# Altium schematic sheet Sheet1.SchDoc
size A4; SheetNumber: 1; SheetTotal: 1
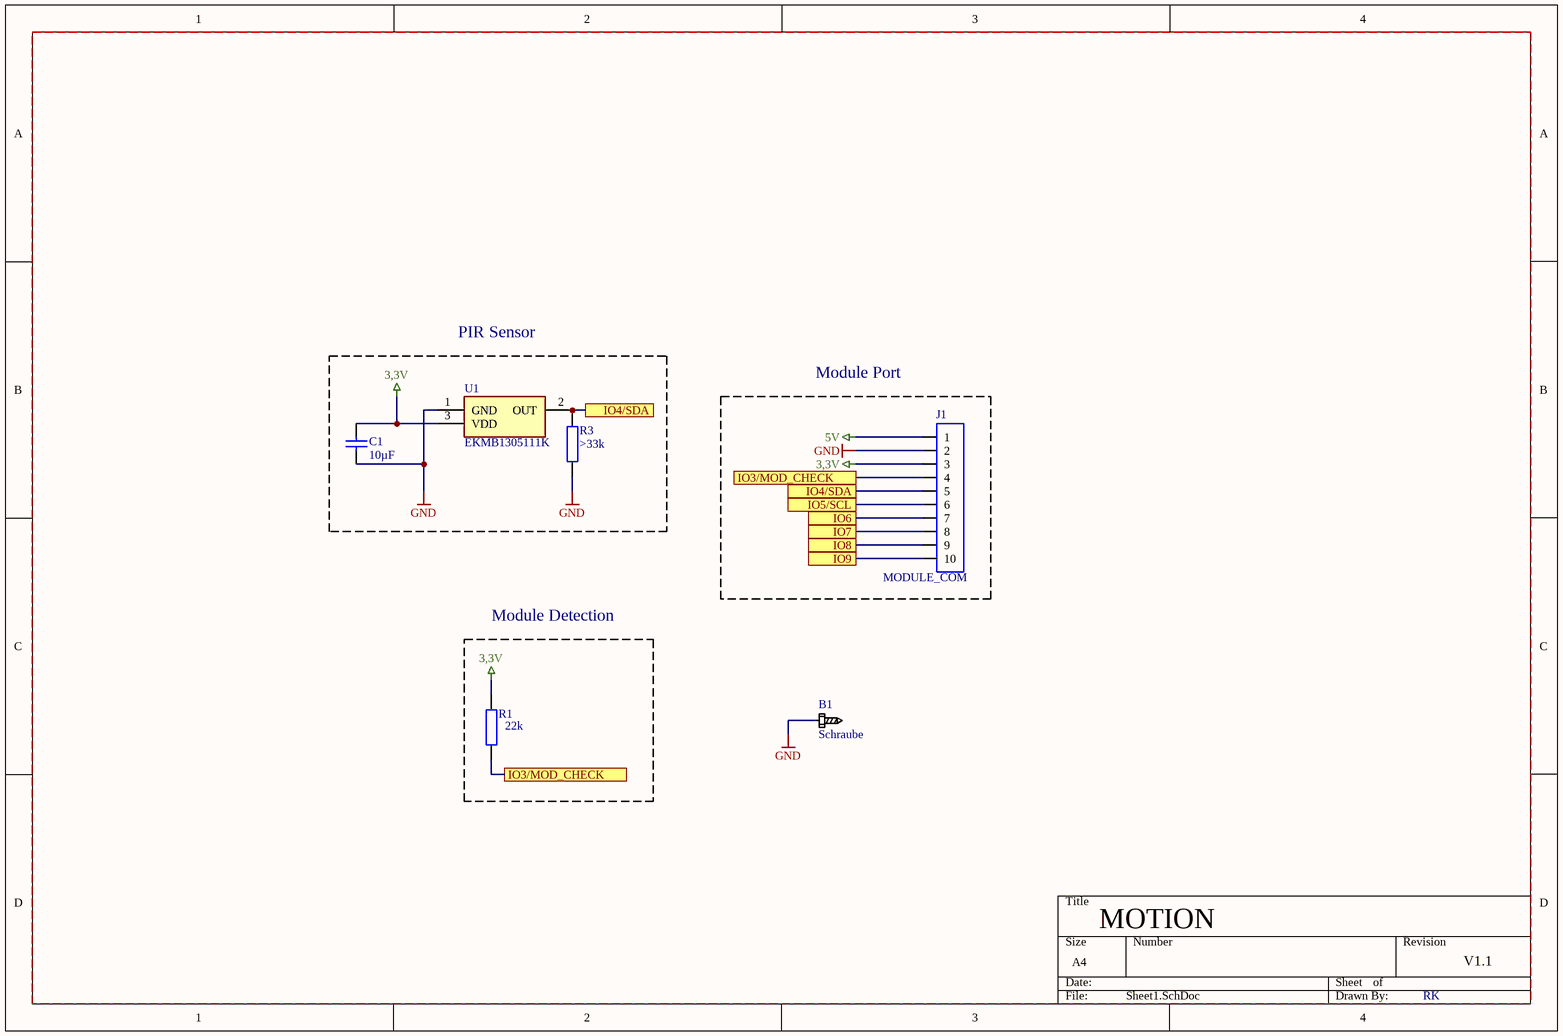
[diagram p0: Sheet1.SchDoc]

## Parts
B1  Schraube  [B_Schraube-M3 PAD]
C1  10µF  [C_SMD_0603]
J1  MODULE_COM  [SIP-10]
R1  22k  [R_SMD_0805]
R3  >33k  [R_SMD_0805]
U1  EKMB1305111K  [EKMB1305111K]

## Blocks framed on the sheet
PIR Sensor: C1 R3 U1
Module Port: J1
Module Detection: R1

## Ports
IO3/MOD_CHECK (see Sheet1[2B]), IO3/MOD_CHECK (see Sheet1[2D]), IO4/SDA (see Sheet1[2B]), IO4/SDA (see Sheet1[3B]), IO5/SCL, IO6, IO7, IO8, IO9

## Nets
3,3V: C1.2 J1.3 R1.2 U1.3(VDD)
5V: J1.1
GND: B1.1(PAD) C1.1 J1.2 R3.1 U1.1(GND)
IO3/MOD_CHECK: J1.4 R1.1 ; port IO3/MOD_CHECK
IO4/SDA: J1.5 R3.2 U1.2(OUT) ; port IO4/SDA
IO5/SCL: J1.6 ; port IO5/SCL
IO6: J1.7 ; port IO6
IO7: J1.8 ; port IO7
IO8: J1.9 ; port IO8
IO9: J1.10 ; port IO9

## Notes on the sheet
- MOTION
- V1.1
- RK

## Library data of the parts
B1 = B_Schraube: Schraubenloch für M3 Schrauben
C1 = C_SMD_KO: Kondensator SMD Universal, Keramik, Folie, usw.; Spannung: *; Bauform: *; Typ: *
J1 = J_THT_CON10: Stecker
R1 R3 = R_SMD_Widerstand: Widerstand SMD
U1 = EKMB1305111K: Undefined or Miscellaneous; Manufacturer_Name: Panasonic; Datasheet Link: https://datasheet.datasheetarchive.com/originals/distributors/DKDS41/DSANUWW0039436.pdf; Height: 16.6mm; Manufacturer_Part_Number: EKMB1305111K; Mouser Part Number: 667-EKMB1305111K; Mouser Price/Stock: https://www.mouser.co.uk/ProductDetail/Panasonic/EKMB1305111K?qs=YCa%2FAAYMW02Pb%252BcF%2FXXwVw%3D%3D; Arrow Part Number: EKMB1305111K; Arrow Price/Stock: https://www.arrow.com/en/products/ekmb1305111k/panasonic